# EAGLE design rc6551z80_18_v1 (EAGLE 9.6.2)
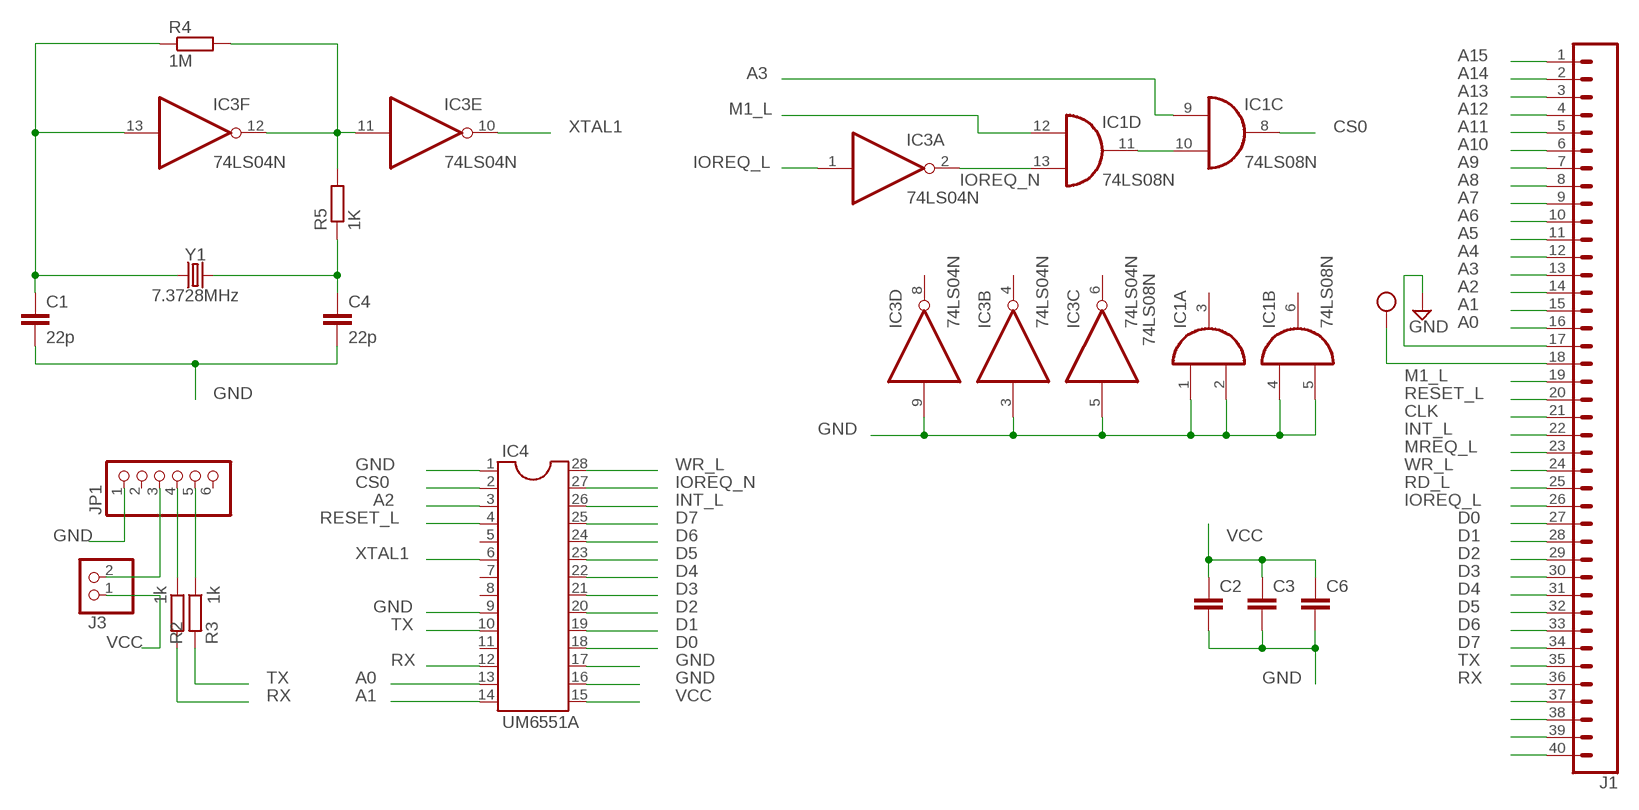
[diagram p0: schematic, sheet 1]

## Parts
C1  22p  C-EU025-024X044  [C025-024X044]
C2  C-EU050-025X075  [C050-025X075]
C3  C-EU050-025X075  [C050-025X075]
C4  22p  C-EU025-024X044  [C025-024X044]
C6  C-EU050-025X075  [C050-025X075]
IC1  74LS08N  [DIL14]
IC3  74LS04N  [DIL14]
IC4  UM6551A  DIL28  [DIL28-6]
J1  CONN_40OFFSET  [1X40_OFFSET]
J3  PINHD-1X2  [1X02]
JP1  PINHD-1X6  [1X06]
R2  1k  R-EU_0204/7  [0204/7]
R3  1k  R-EU_0204/7  [0204/7]
R4  1M  R-EU_0204/7  [0204/7]
R5  1K  R-EU_0204/7  [0204/7]
Y1  7.3728MHz  CRYSTALPTH-HC49UV  [HC49U]

## Nets
A0: IC4.13 J1.16
A1: IC4.14 J1.15
A2: IC4.3 J1.14
A3: IC1.9(C:I0) J1.13
A4: J1.12
A5: J1.11
A6: J1.10
A7: J1.9
A8: J1.8
A9: J1.7
A10: J1.6
A11: J1.5
A12: J1.4
A13: J1.3
A14: J1.2
A15: J1.1
CLK: J1.21
CS0: IC1.8(C:O) IC4.2
D0: IC4.18 J1.27
D1: IC4.19 J1.28
D2: IC4.20 J1.29
D3: IC4.21 J1.30
D4: IC4.22 J1.31
D5: IC4.23 J1.32
D6: IC4.24 J1.33
D7: IC4.25 J1.34
GND: C1.2 C2.2 C3.2 C4.2 C6.2 IC1.1(A:I0) IC1.2(A:I1) IC1.4(B:I0) IC1.5(B:I1) IC3.3(B:I) IC3.5(C:I) IC3.9(D:I) IC4.1 IC4.9 IC4.16 IC4.17 J1.17 JP1.1
INT_L: IC4.26 J1.22
IOREQ_L: IC3.1(A:I) J1.26
IOREQ_N: IC1.13(D:I1) IC3.2(A:O) IC4.27
M1_L: IC1.12(D:I0) J1.19
MREQ_L: J1.23
N$1: J1.37
N$2: J1.38
N$3: J1.39
N$6: J3.2 JP1.3
N$7: JP1.4 R2.1
N$8: JP1.5 R3.1
N$9: C1.1 IC3.13(F:I) R4.1 Y1.1
N$10: C4.1 R5.1 Y1.2
N$11: IC3.11(E:I) IC3.12(F:O) R4.2 R5.2
N$13: J1.40
N$16: IC1.10(C:I1) IC1.11(D:O)
RD_L: J1.25
RESET_L: IC4.4 J1.20
RX: IC4.12 J1.36 R2.2
TX: IC4.10 J1.35 R3.2
VCC: C2.1 C3.1 C6.1 IC4.15 J1.18 J3.1
WR_L: IC4.28 J1.24
XTAL1: IC3.10(E:O) IC4.6
Unconnected: IC1.3(A:O) IC1.6(B:O) IC3.4(B:O) IC3.6(C:O) IC3.8(D:O) IC4.5 IC4.7 IC4.8 IC4.11 JP1.2 JP1.6

## Power pins joined to a net without a drawn wire
GND: IC1.7(P:GND) IC3.7(P:GND)
VCC: IC1.14(P:VCC) IC3.14(P:VCC)

## Library data of the parts
C1 C4 = rcl:C-EU: CAPACITOR, European symbol; SPICEPREFIX: C
C2 C3 C6 = LabE:C-EU: CAPACITOR, European symbol; SPICEPREFIX: C
IC1 = 74xx-eu:74*08: Quad 2-input AND gate
IC3 = 74xx-eu:74*04: Hex INVERTER
IC4 = ic-package:DIL28: Dual In Line
J1 = SparkFun-Connectors:CONN_40: Multi connection point. Often used as Generic Header-pin footprint for 0.1 inch spaced/style header connections On any of the 0.1 inch spaced packages, you can populate with these: Break Away Headers - Straight <https://www.sparkfun.com/products/116> (PRT-00116) Break Away Male Headers - Right Angle <https://www.sparkfun.com/products/553> (PRT-00553) Female Headers <https://www.sparkfun.com/products/115> (PRT-00115) Break Away Headers - Machine Pin <https://www.sparkfun.com/products/117> (PRT-00117) Break Away Female Headers - Swiss Machine Pin <https://www.sparkfun.com/products/743> (PRT-00743) For SCREWTERMINALS and SPRING TERMINALS visit here: Screw Terimnals on SparkFun.com <https://www.sparkfun.com/search/results?term=Screw+Terminals> (5mm/3.5mm/2.54mm spacing) This device is also useful as a general connection point to wire up your design to another part of your project. Our various solder wires solder well into these plated through hole pads. Hook-Up Wire - Assortment (Stranded, 22 AWG) <https://www.sparkfun.com/products/11375> (PRT-11375) Hook-Up Wire - Assortment (Solid Core, 22 AWG) <https://www.sparkfun.com/products/11367> (PRT-11367) View the entire wire category on our website here <https://www.sparkfun.com/categories/141> Special notes: Molex polarized connector foot print use with SKU : PRT-08231 with associated crimp pins and housings. 1MM SMD Version SKU: PRT-10208 NOTES ON THE VARIANTS LOCK and LOCK_LONGPADS... This footprint was designed to help hold the alignment of a through-hole component (i.e. 6-pin header) while soldering it into place. You may notice that each hole has been shifted either up or down by 0.005 of an inch from it's more standard position (which is a perfectly straight line). This slight alteration caused the pins (the squares in the middle) to touch the edges of the holes. Because they are alternating, it causes a "brace" to hold the component in place. 0.005 has proven to be the perfect amount of "off-center" position when using our standard breakaway headers. Although looks a little odd when you look at the bare footprint, once you have a header in there, the alteration is very hard to notice. Also,if you push a header all the way into place, it is covered up entirely on the bottom side.
J3 = pinhead:PINHD-1X2: PIN HEADER
JP1 = pinhead:PINHD-1X6: PIN HEADER
R2-R5 = rcl:R-EU_: RESISTOR, European symbol; SPICEPREFIX: R
Y1 = SparkFun-Clocks:CRYSTAL: Crystals (Generic) These are passive quartz crystals, which can be used as a clock source for a microcontroller. Crystal's are two-terminal devices. They require external "load" capacitors to generate an oscillating signal.

## Board
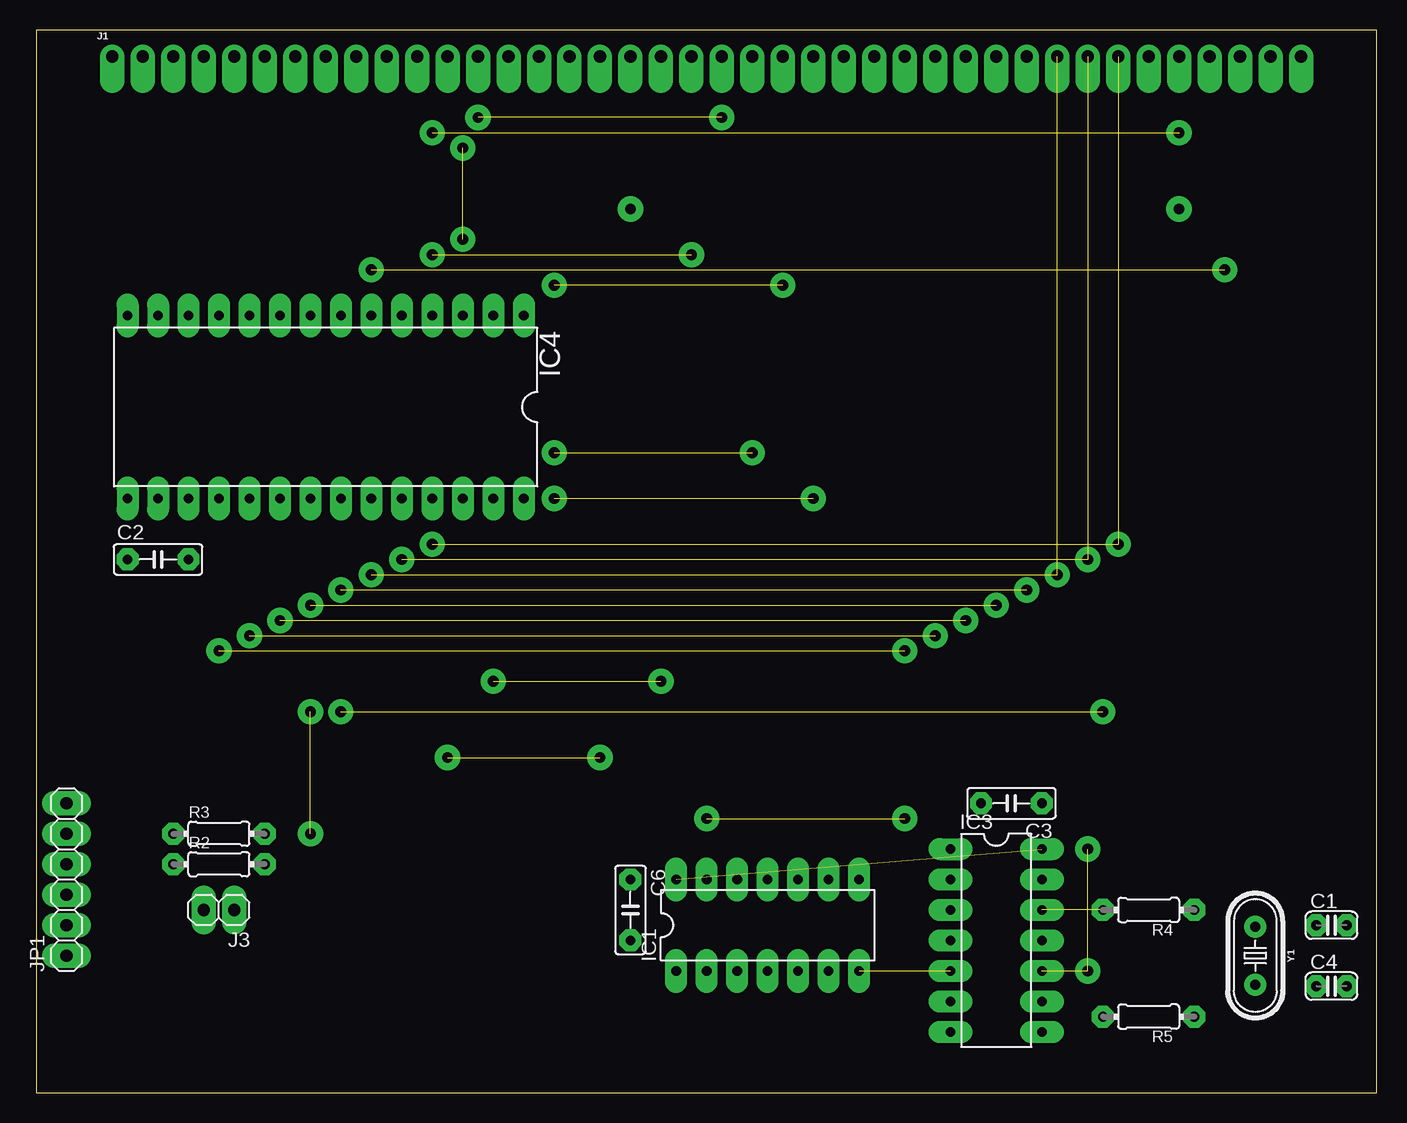
[diagram p1: board, top side]
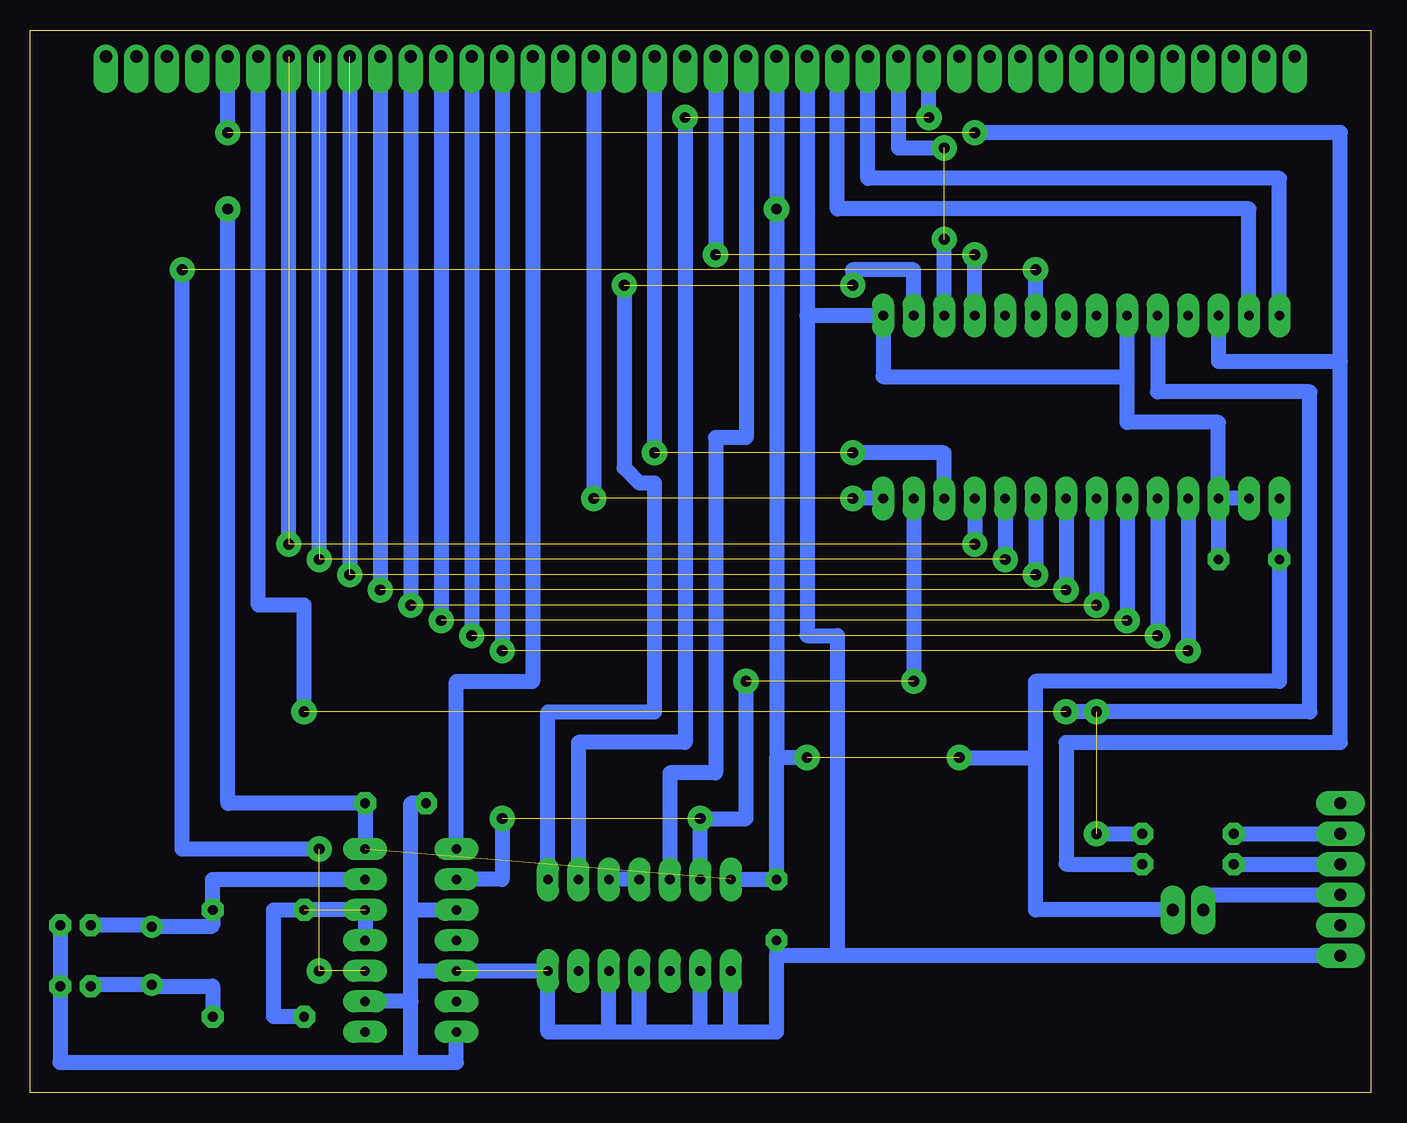
[diagram p2: board, bottom side, seen from below]

Size 111.74 x 88.57 mm. Coordinates in mm from the lower left corner, seen from the top.
Outline: 0,0 111.74,0 111.74,88.57 0,88.57 0,0
Copper layers (1*16): Top 0.035mm / dielectric 1.5mm / Bottom 0.035mm
Design rules "LabE": minimum track width 50mil, minimum drill 0.8mm, track to track 16mil, track to pad 16mil, pad to pad 16mil, via to via 16mil, smd to smd 16mil, copper to edge 0mil, drill to drill 16mil, minimum pad ring 20mil, minimum via ring 20mil, stop-mask expansion 4mil, vias tented up to drill 0mil, thermal gap 10mil

### Footprints (pad centres in the part's own frame; a part is rotated, then mirrored left to right if it is on the bottom)
C025-024X044 = drill 0.813 octagon: 1 -1.27,0; 2 1.27,0
C050-025X075 = drill 0.813 octagon: 1 -2.54,0; 2 2.54,0
DIL14 = drill 0.813 long: 1 -7.62,-3.81; 2 -5.08,-3.81; 3 -2.54,-3.81; 4 0,-3.81; 5 2.54,-3.81; 6 5.08,-3.81; 7 7.62,-3.81; 8 7.62,3.81; 9 5.08,3.81; 10 2.54,3.81; 11 0,3.81; 12 -2.54,3.81; 13 -5.08,3.81; 14 -7.62,3.81
DIL28-6 = drill 0.813 long: 1 -16.51,-7.62; 2 -13.97,-7.62; 3 -11.43,-7.62; 4 -8.89,-7.62; 5 -6.35,-7.62; 6 -3.81,-7.62; 7 -1.27,-7.62; 8 1.27,-7.62; 9 3.81,-7.62; 10 6.35,-7.62; 11 8.89,-7.62; 12 11.43,-7.62; 13 13.97,-7.62; 14 16.51,-7.62; 15 16.51,7.62; 16 13.97,7.62; 17 11.43,7.62; 18 8.89,7.62; 19 6.35,7.62; 20 3.81,7.62; 21 1.27,7.62; 22 -1.27,7.62; 23 -3.81,7.62; 24 -6.35,7.62; 25 -8.89,7.62; 26 -11.43,7.62; 27 -13.97,7.62; 28 -16.51,7.62
1X40_OFFSET = drill 1.016 pad 1.88 offset: 1 0,0; 2 2.54,0; 3 5.08,0; 4 7.62,0; 5 10.16,0; 6 12.7,0; 7 15.24,0; 8 17.78,0; 9 20.32,0; 10 22.86,0; 11 25.4,0; 12 27.94,0; 13 30.48,0; 14 33.02,0; 15 35.56,0; 16 38.1,0; 17 40.64,0; 18 43.18,0; 19 45.72,0; 20 48.26,0; 21 50.8,0; 22 53.34,0; 23 55.88,0; 24 58.42,0; 25 60.96,0; 26 63.5,0; 27 66.04,0; 28 68.58,0; 29 71.12,0; 30 73.66,0; 31 76.2,0; 32 78.74,0; 33 81.28,0; 34 83.82,0; 35 86.36,0; 36 88.9,0; 37 91.44,0; 38 93.98,0; 39 96.52,0; 40 99.06,0
1X02 = drill 1.016 long: 1 -1.27,0; 2 1.27,0
1X06 = drill 1.016 long: 1 -6.35,0; 2 -3.81,0; 3 -1.27,0; 4 1.27,0; 5 3.81,0; 6 6.35,0
0204/7 = drill 0.813 octagon: 1 -3.81,0; 2 3.81,0
HC49U = drill 0.813: 1 -2.413,0; 2 2.413,0

### Placement (x,y rotation side)
C1  107.95,13.97 0 top
C2  10.16,44.45 0 top
C3  81.28,24.13 180 top
C4  107.95,8.89 0 top
C6  49.53,15.24 270 top
IC1  60.96,13.97 0 top
IC3  80.01,12.7 270 top
IC4  24.13,57.15 180 top
J1  6.35,86.36 0 top
J3  15.24,15.24 180 top
JP1  2.54,17.78 90 top
R2  15.24,19.05 0 top
R3  15.24,21.59 0 top
R4  92.71,15.24 180 top
R5  92.71,6.35 180 top
Y1  101.6,11.43 270 top

### Tracks (layer width: path | path; a pad name or v marks a point on that pad's centre or on a via)
A0
  Bottom 1.27: IC4.13 10.16,73.66 44.45,73.66 J1.16
A1
  Bottom 1.27: IC4.14 7.62,76.2 41.91,76.2 J1.15
A2  (via drill 0.9 pad 2.1)  (1 unrouted)
  Bottom 1.27: IC4.3 v35.56,71.12 | J1.14 39.37,78.74 v35.56,78.74
A3  (via drill 0.9 pad 2.1)  (1 unrouted)
  Bottom 1.27: IC1.9 66.04,29.21 57.15,29.21 v57.15,81.28 | v36.83,81.28 J1.13
CS0  (via drill 0.9 pad 2.1)  (1 unrouted)
  Bottom 1.27: IC1.8 68.58,31.75 59.69,31.75 59.69,50.8 60.96,50.8 62.23,52.07 v62.23,67.31 | IC4.2 38.1,68.58 43.18,68.58 v43.18,67.31
D0  (via drill 0.9 pad 2.1)  (1 unrouted)
  Bottom 1.27: IC4.18 v15.24,36.83 | J1.27 v72.39,36.83
D1  (via drill 0.9 pad 2.1)  (1 unrouted)
  Bottom 1.27: IC4.19 v17.78,38.1 | J1.28 v74.93,38.1
D2  (via drill 0.9 pad 2.1)  (1 unrouted)
  Bottom 1.27: IC4.20 v20.32,39.37 | J1.29 v77.47,39.37
D3  (via drill 0.9 pad 2.1)  (1 unrouted)
  Bottom 1.27: IC4.21 v22.86,40.64 | J1.30 v80.01,40.64
D4  (via drill 0.9 pad 2.1)  (1 unrouted)
  Bottom 1.27: IC4.22 v25.4,41.91 | J1.31 v82.55,41.91
D5  (via drill 0.9 pad 2.1)  (2 unrouted)
  Bottom 1.27: IC4.23 v27.94,43.18 | J1.32 v85.09,43.18
D6  (via drill 0.9 pad 2.1)  (2 unrouted)
  Bottom 1.27: IC4.24 v30.48,44.45 | v87.63,44.45 J1.33
D7  (via drill 0.9 pad 2.1)  (2 unrouted)
  Bottom 1.27: IC4.25 v33.02,45.72 | v90.17,45.72 J1.34
GND  (1 unrouted)
  Bottom 1.27: C1.2 C4.2 109.22,2.54 80.01,2.54 | 80.01,2.54 76.2,2.54 IC3.7 | 80.01,2.54 80.01,7.62 | 80.01,7.62 IC3.9 | 46.99,64.77 IC4.1 40.64,59.69 20.32,59.69 | J1.17 46.99,64.77 | IC4.16 IC4.17 | IC4.17 12.7,55.88 20.32,55.88 20.32,59.69 | 20.32,59.69 IC4.9 | 80.01,7.62 80.01,10.16 | 80.01,10.16 80.01,15.24 | 80.01,15.24 80.01,24.13 C3.2 | 46.99,64.77 46.99,38.1 44.45,38.1 44.45,11.43 | 63.5,5.08 68.58,5.08 IC1.7 IC3.5 80.01,10.16 | 63.5,5.08 60.96,5.08 | 60.96,5.08 55.88,5.08 | 55.88,5.08 53.34,5.08 | 53.34,5.08 49.53,5.08 49.53,11.43 | 80.01,15.24 IC3.3 | 53.34,5.08 IC1.1 | 55.88,5.08 IC1.2 | 60.96,5.08 IC1.4 | 63.5,5.08 IC1.5 | JP1.1 44.45,11.43 | 44.45,11.43 49.53,11.43 | C6.2 49.53,11.43 | IC4.17 C2.2
INT_L  (via drill 0.9 pad 2.1)  (1 unrouted)
  Bottom 1.27: IC4.26 35.56,53.34 v43.18,53.34 | v59.69,53.34 J1.22
IOREQ_L
  Bottom 1.27: J1.26 69.85,34.29 76.2,34.29 IC3.1
IOREQ_N  (via drill 0.9 pad 2.1)  (2 unrouted)
  Bottom 1.27: IC1.13 v55.88,22.86 52.07,22.86 v52.07,34.29 | v72.39,22.86 72.39,17.78 IC3.2 | IC4.27 v38.1,34.29
M1_L
  Bottom 1.27: J1.19 52.07,54.61 54.61,54.61 54.61,26.67 58.42,26.67 IC1.12
N$6
  Bottom 1.27: J3.2 13.97,16.51 JP1.3
N$7
  Bottom 1.27: R2.1 JP1.4
N$8
  Bottom 1.27: R3.1 JP1.5
N$9
  Bottom 1.27: C1.1 101.73,13.97 Y1.1 96.65,13.84 96.52,13.97 R4.1 96.52,17.78 IC3.13
N$10
  Bottom 1.27: C4.1 106.55,9.02 Y1.2 101.47,8.89 96.52,8.89 R5.1
N$11  (1 unrouted)
  Bottom 1.27: IC3.11 IC3.12 R4.2 91.44,15.24 91.44,6.35 R5.2
N$16
  Bottom 1.27: IC1.11 IC1.10
RESET_L  (via drill 0.9 pad 2.1)  (1 unrouted)
  Bottom 1.27: J1.20 v54.61,69.85 | IC4.4 v33.02,69.85
RX  (via drill 0.9 pad 2.1)  (1 unrouted)
  Bottom 1.27: IC4.12 12.7,60.96 2.54,60.96 | 2.54,60.96 2.54,29.21 25.4,29.21 25.4,19.05 R2.2 | 2.54,60.96 2.54,80.01 v33.02,80.01 | v95.25,80.01 J1.36
TX  (via drill 0.9 pad 2.1)  (2 unrouted)
  Bottom 1.27: IC4.10 17.78,58.42 5.08,58.42 5.08,31.75 v22.86,31.75 v25.4,31.75 | v22.86,21.59 R3.2 | v88.9,31.75 88.9,40.64 92.71,40.64 J1.35
VCC  (via drill 0.9 pad 2.1)  (2 unrouted)
  Bottom 1.27: J3.1 27.94,15.24 27.94,27.94 | 27.94,27.94 27.94,34.29 7.62,34.29 C2.1 IC4.15 | J1.18 v49.53,73.66 49.53,27.94 | v34.29,27.94 27.94,27.94 | IC3.14 C3.1 95.25,24.13 v95.25,73.66 | v46.99,27.94 49.53,27.94 | IC1.14 C6.1 49.53,27.94
WR_L  (via drill 0.9 pad 2.1)  (1 unrouted)
  Bottom 1.27: IC4.28 v43.18,49.53 | J1.24 v64.77,49.53
XTAL1  (via drill 0.9 pad 2.1)  (3 unrouted)
  Bottom 1.27: IC4.6 v27.94,68.58 | v87.63,20.32 99.06,20.32 v99.06,68.58
  other vias: 87.63,10.16